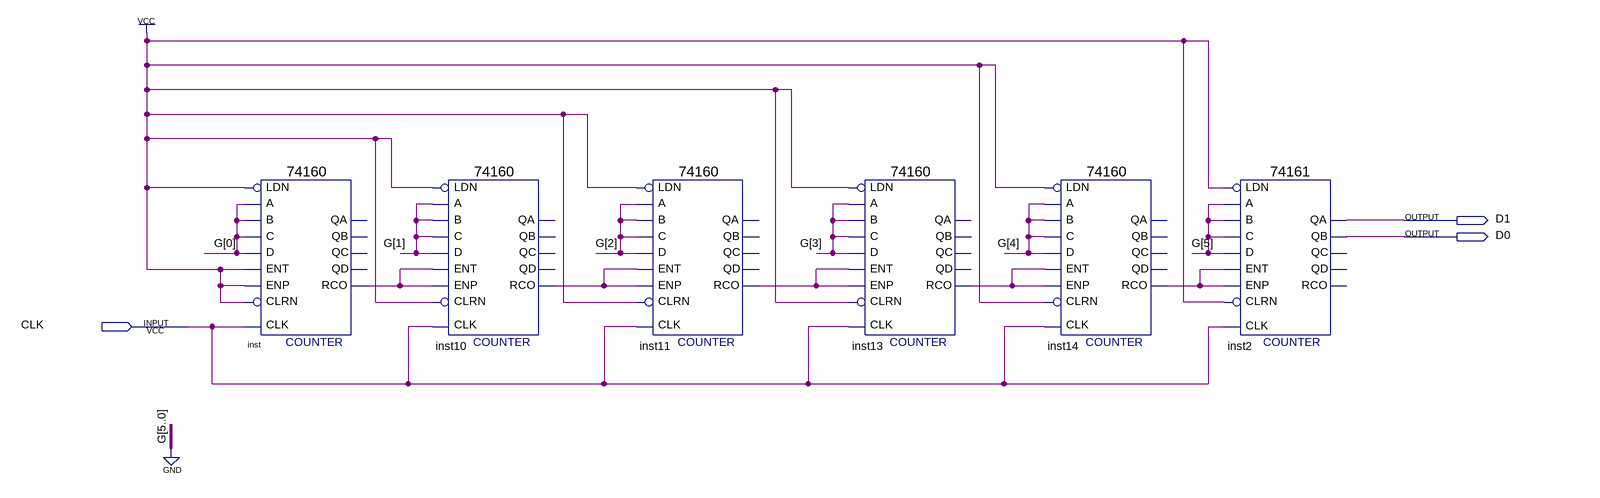
[diagram p0: schematic sheet]
// Quartus schematic counter.bdf as structural Verilog: 6 symbols, 3 pins
module counter (
  input  CLK,
  output D1,
  output D0
);

  wire inst10_rco, inst11_rco, inst13_rco, inst14_rco, inst_rco;

  \74160  inst (
    .CLK(CLK), .ENT(1'b1), .A(1'b0), .B(1'b0), .C(1'b0), .D(1'b0), .LDN(1'b1), .ENP(1'b1), .CLRN(1'b1),
    .RCO(inst_rco));  // open: QD, QA, QB, QC
  \74160  inst10 (
    .CLK(CLK), .ENT(inst_rco), .A(1'b0), .B(1'b0), .C(1'b0), .D(1'b0), .LDN(1'b1), .ENP(inst_rco),
    .CLRN(1'b1), .RCO(inst10_rco));  // open: QD, QA, QB, QC
  \74160  inst11 (
    .CLK(CLK), .ENT(inst10_rco), .A(1'b0), .B(1'b0), .C(1'b0), .D(1'b0), .LDN(1'b1), .ENP(inst10_rco),
    .CLRN(1'b1), .RCO(inst11_rco));  // open: QD, QA, QB, QC
  \74160  inst13 (
    .CLK(CLK), .ENT(inst11_rco), .A(1'b0), .B(1'b0), .C(1'b0), .D(1'b0), .LDN(1'b1), .ENP(inst11_rco),
    .CLRN(1'b1), .RCO(inst13_rco));  // open: QD, QA, QB, QC
  \74160  inst14 (
    .CLK(CLK), .ENT(inst13_rco), .A(1'b0), .B(1'b0), .C(1'b0), .D(1'b0), .LDN(1'b1), .ENP(inst13_rco),
    .CLRN(1'b1), .RCO(inst14_rco));  // open: QD, QA, QB, QC
  \74161  inst2 (
    .CLRN(1'b1), .CLK(CLK), .ENP(inst14_rco), .LDN(1'b1), .A(1'b0), .D(1'b0), .ENT(inst14_rco), .B(1'b0),
    .C(1'b0), .QB(D0), .QA(D1));  // open: QD, QC, RCO
endmodule
